# Altium schematic sheet Sheet1.SchDoc
size A4
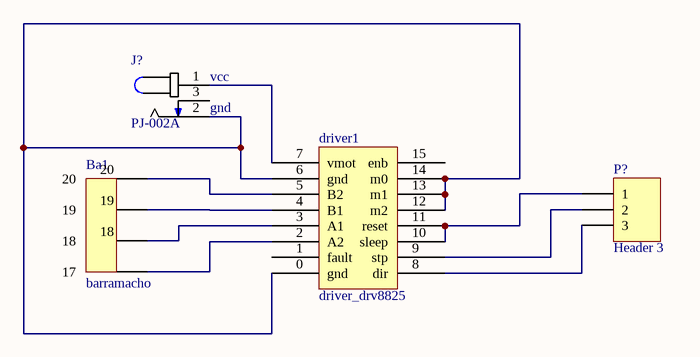
[diagram p0: Sheet1.SchDoc]

## Parts
Ba1  barramacho  [barramacho]
driver1  driver_drv8825  [drive_drv8825]
J?  PJ-002A  [*CUI_PJ-002A]
P?  Header 3  [HDR1X3]

## Nets
NetBa1_17: Ba1.17 driver1.2(A2)
NetBa1_18: Ba1.18 driver1.3(A1)
NetBa1_19: Ba1.19 driver1.4(B1)
NetBa1_20: Ba1.20 driver1.5(B2)
Netdriver1_0: driver1.0(gnd) driver1.6(gnd) driver1.12(m2) driver1.13(m1) driver1.14(m0) J?.2
Netdriver1_7: driver1.7(vmot) J?.1
Netdriver1_8: driver1.8(dir) P?.3
Netdriver1_9: driver1.9(stp) P?.2
Netdriver1_10: driver1.10(sleep) driver1.11(reset) P?.1

Not connected (* = marked no-connect by the designer): driver1 1(fault) 15(enb); J? 3

## Notes on the sheet
- (near J?) vcc
- (near J?) gnd

## Library data of the parts
Ba1 = Ba?: barra macho de 4 pinos
P? = Header 3: Header, 3-Pin; LatestRevisionDate: 17-Jul-2002; LatestRevisionNote: Re-released for DXP Platform.; Publisher: Altium Limited
J? = PJ-002A: Value: *